# Altium schematic sheet ESP32.SchDoc: Motherboard-ESP32
size A3; DrawnBy: Patryk Bujak; DocumentNumber: 12; Revision: 1.0; SheetNumber: 9; SheetTotal: 10; Author: Patryk Bujak
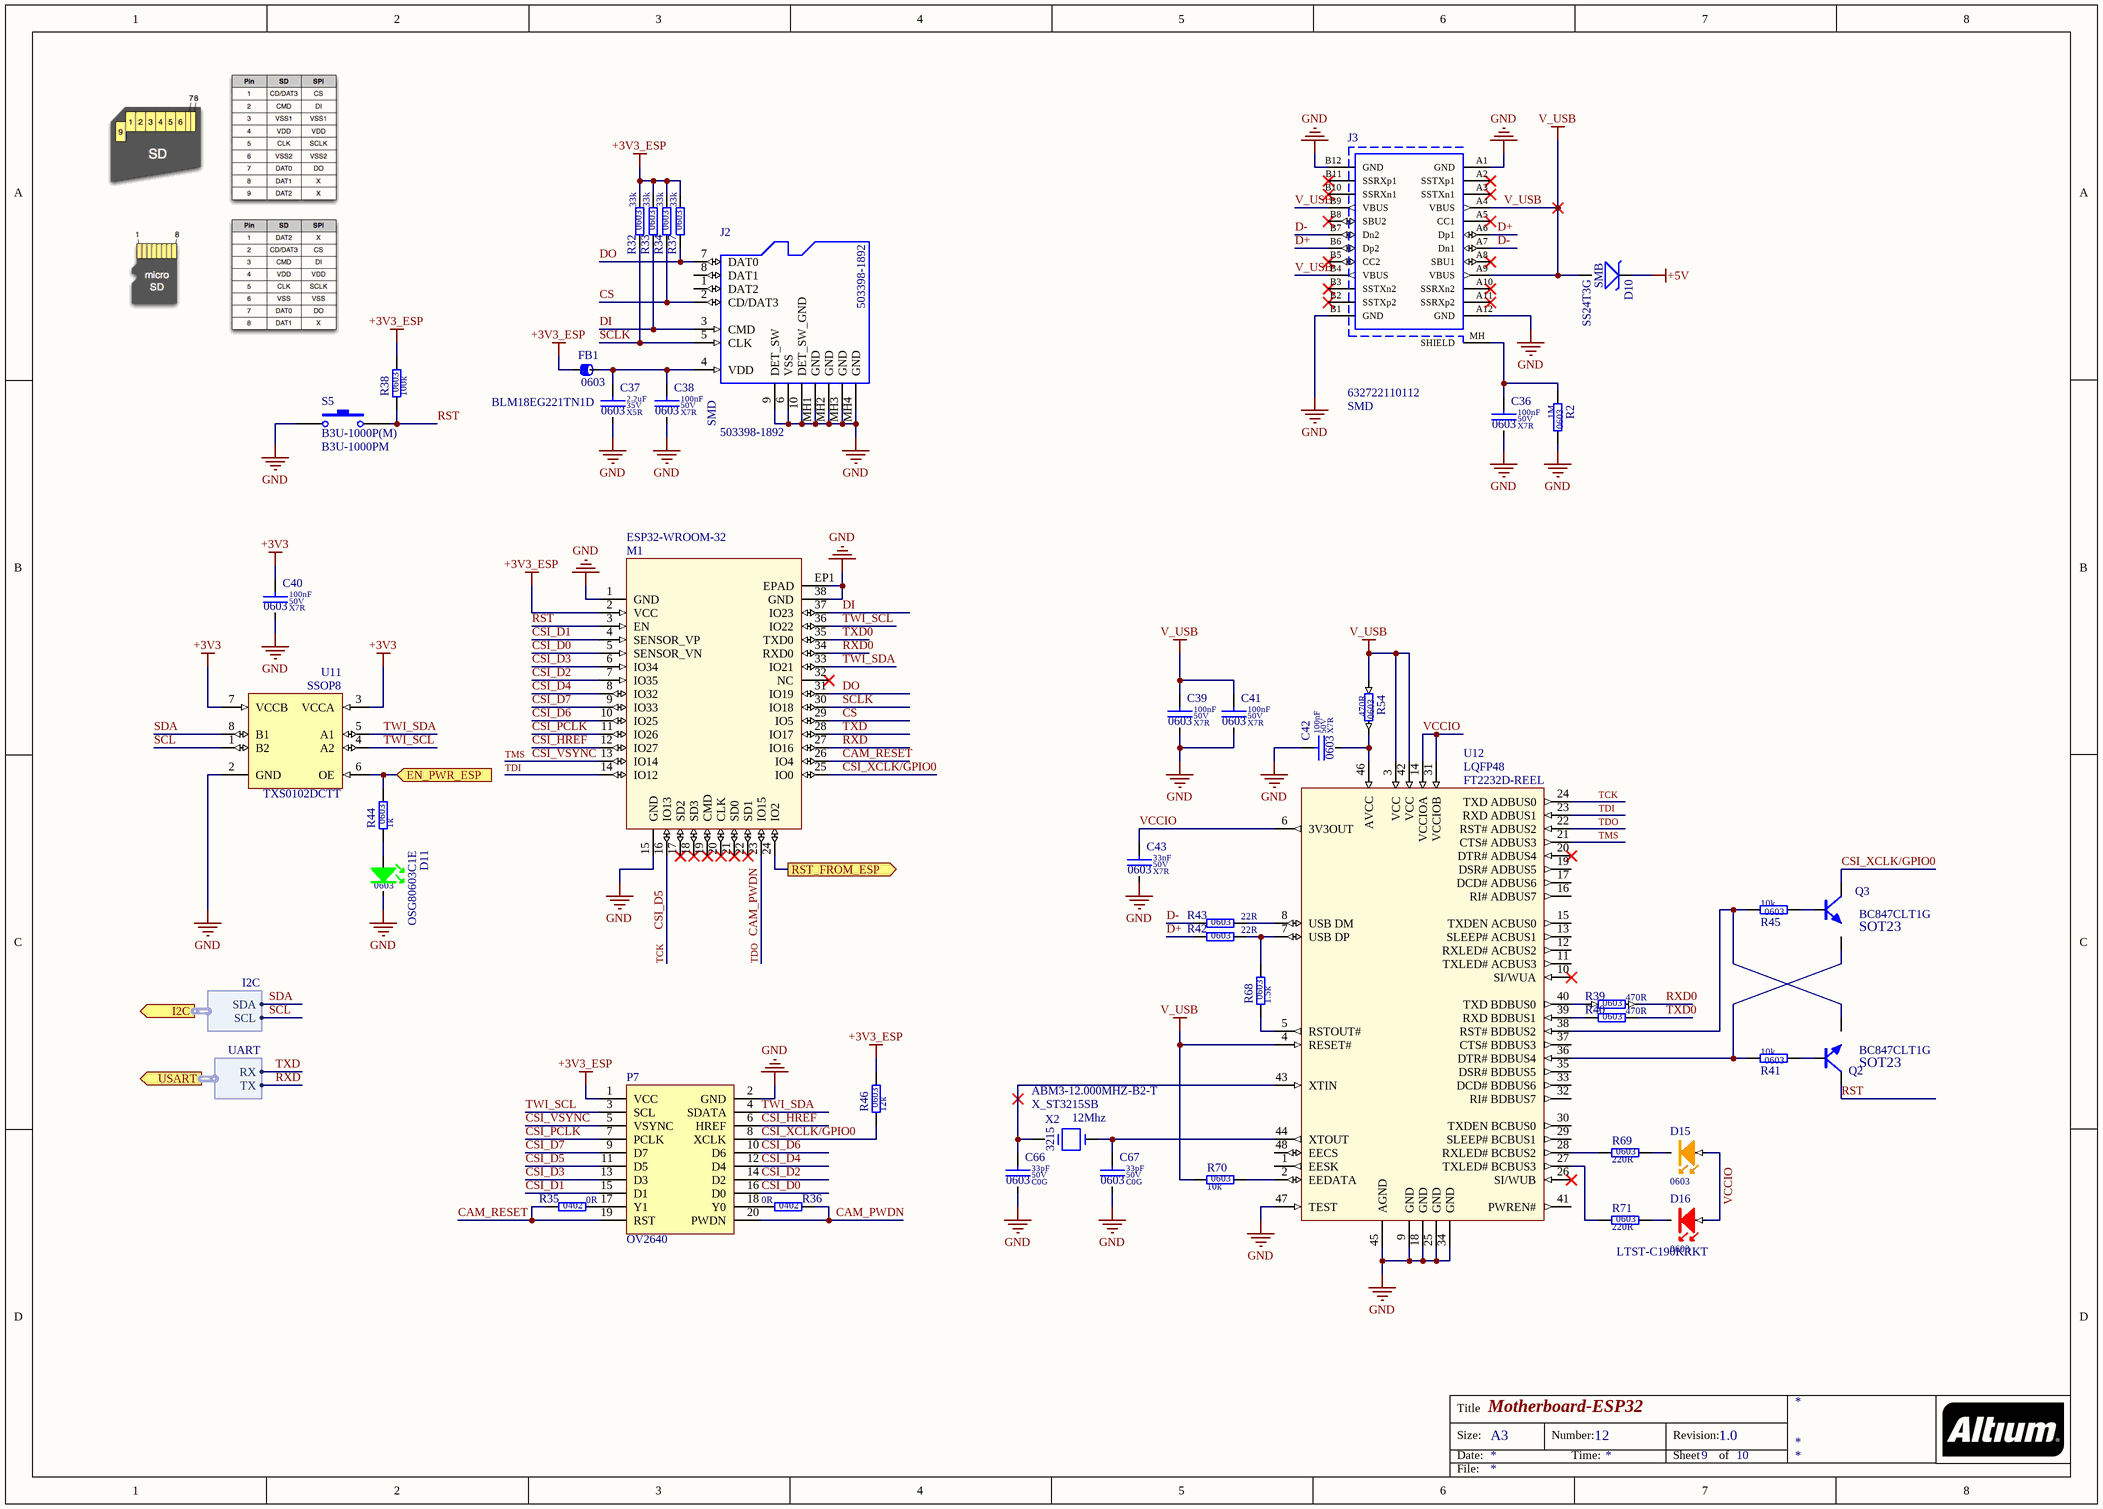
[diagram p0: ESP32.SchDoc]

## Parts
C36  value 100nF  Dielectric: X7R  Voltage: 50V  SCH_Footprint: 0603  [C_0603_1608]  (hidden comment: Ceramic X7R)
C37  value 2.2uF  Dielectric: X5R  Voltage: 35V  SCH_Footprint: 0603  [C_0603_1608]  (hidden comment: Ceramic X5R)
C38  value 100nF  Dielectric: X7R  Voltage: 50V  SCH_Footprint: 0603  [C_0603_1608]  (hidden comment: Ceramic X7R)
C39  value 100nF  Dielectric: X7R  Voltage: 50V  SCH_Footprint: 0603  [C_0603_1608]  (hidden comment: Ceramic X7R)
C40  value 100nF  Dielectric: X7R  Voltage: 50V  SCH_Footprint: 0603  [C_0603_1608]  (hidden comment: Ceramic X7R)
C41  value 100nF  Dielectric: X7R  Voltage: 50V  SCH_Footprint: 0603  [C_0603_1608]  (hidden comment: Ceramic X7R)
C42  value 100nF  Dielectric: X7R  Voltage: 50V  SCH_Footprint: 0603  [C_0603_1608]  (hidden comment: Ceramic X7R)
C43  value 33nF  Dielectric: X7R  Voltage: 50V  SCH_Footprint: 0603  [C_0603_1608]  (hidden comment: Ceramic X7R)
C66  value 33pF  Dielectric: C0G  Voltage: 50V  SCH_Footprint: 0603  [C_0603_1608]  (hidden comment: Ceramic C0G)
C67  value 33pF  Dielectric: C0G  Voltage: 50V  SCH_Footprint: 0603  [C_0603_1608]  (hidden comment: Ceramic C0G)
D10  value SS24T3G  SCH_Footprint: SMB  [SMB_DO-214AA]  (hidden comment: SS24)
D11  value OSG80603C1E  SCH_Footprint: 0603  [OL_0603_1608]  (hidden comment: Green led)
D15  SCH_Footprint: 0603  [OL_0603_1608]  (hidden comment: OL_O)
D16  value LTST-C190KRKT  SCH_Footprint: 0603  [OL_0603_1608]  (hidden comment: Red Led)
FB1  value BLM18EG221TN1D  SCH_Footprint: 0603  [FB_0603_1608]  (hidden comment: Ferrite bead)
J2  value 503398-1892  SCH_Footprint: SMD  [503398-1892]  (hidden comment: SD Card Connector)
J3  value 632722110112  SCH_Footprint: SMD  [J_USB_C_3.1_Vertical]  (hidden comment: USB C Connector)
M1  value ESP32-WROOM-32  [MOD_ESP_WROOM_32]  (hidden comment: 2.4 GHz Wi-Fi-and-Bluetooth combo chip)
P7  OV2640  [H2X10_OV2640]
Q2  value BC847CLT1G  SCH_Footprint: SOT23  [SOT23_TO236_SC59]  (hidden comment: BC847C)
Q3  value BC847CLT1G  SCH_Footprint: SOT23  [SOT23_TO236_SC59]  (hidden comment: BC847C)
R2  value 1M  SCH_Footprint: 0603  [R_0603_1608]  (hidden comment: Resistor)
R32  value 33k  SCH_Footprint: 0603  [R_0603_1608]  (hidden comment: Resistor)
R33  value 33k  SCH_Footprint: 0603  [R_0603_1608]  (hidden comment: Resistor)
R34  value 33k  SCH_Footprint: 0603  [R_0603_1608]  (hidden comment: Resistor)
R35  value 0R  SCH_Footprint: 0402  [R_0402_1005]  (hidden comment: Resistor)
R36  value 0R  SCH_Footprint: 0402  [R_0402_1005]  (hidden comment: Resistor)
R37  value 33k  SCH_Footprint: 0603  [R_0603_1608]  (hidden comment: Resistor)
R38  value 100k  SCH_Footprint: 0603  [R_0603_1608]  (hidden comment: Resistor)
R39  value 470R  SCH_Footprint: 0603  [R_0603_1608]  (hidden comment: Resistor)
R40  value 470R  SCH_Footprint: 0603  [R_0603_1608]  (hidden comment: Resistor)
R41  value 10k  SCH_Footprint: 0603  [R_0603_1608]  (hidden comment: Resistor)
R42  value 22R  SCH_Footprint: 0603  [R_0603_1608]  (hidden comment: Resistor)
R43  value 22R  SCH_Footprint: 0603  [R_0603_1608]  (hidden comment: Resistor)
R44  value 1k  SCH_Footprint: 0603  [R_0603_1608]  (hidden comment: Resistor)
R45  value 10k  SCH_Footprint: 0603  [R_0603_1608]  (hidden comment: Resistor)
R46  value 12k  SCH_Footprint: 0603  [R_0603_1608]  (hidden comment: Resistor)
R54  value 470R  SCH_Footprint: 0603  [R_0603_1608]  (hidden comment: Resistor)
R68  value 1.5k  SCH_Footprint: 0603  [R_0603_1608]  (hidden comment: Resistor)
R69  value 220R  SCH_Footprint: 0603  [R_0603_1608]  (hidden comment: Resistor)
R70  value 10k  SCH_Footprint: 0603  [R_0603_1608]  (hidden comment: Resistor)
R71  value 220R  SCH_Footprint: 0603  [R_0603_1608]  (hidden comment: Resistor)
S5  value B3U-1000PM  SCH_Footprint: B3U-1000P(M)  [B3U-1000P]  (hidden comment: Ultra-small Tactile Switch)
U11  value TXS0102DCTT  SCH_Footprint: SSOP8  [SSOP8_3x3]  (hidden comment: 2-Bit Bidirectional Voltage-Level Shifter for Open-Drain and Push-Pull Application 8-VSSOP -40 to 85)
U12  value FT2232D-REEL  SCH_Footprint: LQFP48  [LQFP48_7x7]  (hidden comment: FT2232D)
X2  value 12Mhz  Manufacturer Part Number: ABM3-12.000MHZ-B2-T  [X_ABM3-12.000MHZ-B2-T]  (hidden comment: X_ST3215SB)

## Ports
EN_PWR_ESP (in), I2C (out, harness I2C), RST_FROM_ESP (out), USART (out, harness UART)

## Harnesses
I2C: SDA, SCL
UART: RX, TX

## Nets
+3V3: C40.1 U11.3(VCCA) U11.7(VCCB)
+3V3_ESP: FB1.1 M1.2(VCC) P7.1(VCC) R32.2 R33.2 R34.2 R37.2 R38.2 R46.2
+5V: D10.1
GND: C36.2 C37.2 C38.2 C39.2 C40.2 C41.2 C42.1 C43.2 C66.2 C67.2 D11.1(K) J2.6(VSS) J2.9(DET_SW) J2.10(DET_SW_GND) J2.MH1(GND) J2.MH2(GND) J2.MH3(GND) J2.MH4(GND) J3.A1(GND) J3.A12(GND) J3.B1(GND) J3.B12(GND) M1.1(GND) M1.15(GND) M1.38(GND) M1.EP1(EPAD) P7.2(GND) R2.2 S5.1 U11.2(GND) U12.9(GND) U12.18(GND) U12.25(GND) U12.34(GND) U12.45(AGND) U12.47(TEST)
V_USB: C39.1 C41.1 D10.2 J3.A4(VBUS) J3.A9(VBUS) J3.B4(VBUS) J3.B9(VBUS) R54.1 R70.1 U12.3(VCC) U12.4(RESET#) U12.42(VCC)
CAM_PWDN: M1.23(IO15) P7.20(PWDN) R36.2 U12.22(RST#_ADBUS2)  [also labelled TDO]
CAM_RESET: M1.26(IO4) P7.19(RST) R35.1
CS: J2.2(CD/DAT3) M1.29(IO5) R34.1
CSI_D0: M1.5(SENSOR_VN) P7.16(D0)
CSI_D1: M1.4(SENSOR_VP) P7.15(D1)
CSI_D2: M1.7(IO35) P7.14(D2)
CSI_D3: M1.6(IO34) P7.13(D3)
CSI_D4: M1.8(IO32) P7.12(D4)
CSI_D5: M1.16(IO13) P7.11(D5) U12.24(TXD_ADBUS0)  [also labelled TCK]
CSI_D6: M1.10(IO25) P7.10(D6)
CSI_D7: M1.9(IO33) P7.9(D7)
CSI_HREF: M1.12(IO27) P7.6(HREF)
CSI_PCLK: M1.11(IO26) P7.7(PCLK)
CSI_VSYNC: M1.13(IO14) P7.5(VSYNC) U12.21(CTS#_ADBUS3)  [also labelled TMS]
CSI_XCLK/GPIO0: M1.25(IO0) P7.8(XCLK) Q3.3(C) R46.1
D+: J3.A6(Dp1) J3.B6(Dp2) R42.1
D-: J3.A7(Dn1) J3.B7(Dn2) R43.1
DI: J2.3(CMD) M1.37(IO23) R33.1
DO: J2.7(DAT0) M1.31(IO19) R37.1
EN_PWR_ESP: R44.2 U11.6(OE) ; port EN_PWR_ESP
RST: M1.3(EN) Q2.3(C) R38.1 S5.2
RST_FROM_ESP: M1.24(IO2) ; port RST_FROM_ESP
RXD: M1.27(IO16) ; port USART.TX
RXD0: M1.34(RXD0) R39.2
SCL: U11.1(B2) ; port I2C.SCL
SCLK: J2.5(CLK) M1.30(IO18) R32.1
SDA: U11.8(B1) ; port I2C.SDA
TDI: M1.14(IO12) U12.23(RXD_ADBUS1)
TWI_SCL: M1.36(IO22) P7.3(SCL) U11.4(A2)
TWI_SDA: M1.33(IO21) P7.4(SDATA) U11.5(A1)
TXD: M1.28(IO17) ; port USART.RX
TXD0: M1.35(TXD0) R40.2
VCCIO: C43.1 D15.2(A) D16.2(A) U12.6(3V3OUT) U12.14(VCCIOA) U12.31(VCCIOB)
NetC36_1: C36.1 J3.MH(SHIELD) R2.1
NetC37_1: C37.1 C38.1 FB1.2 J2.4(VDD)
NetC42_2: C42.2 R54.2 U12.46(AVCC)
NetC66_1: C66.1 U12.43(XTIN) X2.1
NetC67_1: C67.1 U12.44(XTOUT) X2.2
NetD11_2: D11.2(A) R44.1
NetD15_1: D15.1(K) R69.2
NetD16_1: D16.1(K) R71.2
NetP7_17: P7.17(Y1) R35.2
NetP7_18: P7.18(Y0) R36.1
NetQ2_1: Q2.1(B) R41.2
NetQ2_2: Q2.2(E) R45.1 U12.38(RST#_BDBUS2)
NetQ3_1: Q3.1(B) R45.2
NetQ3_2: Q3.2(E) R41.1 U12.36(DTR#_BDBUS4)
NetR39_1: R39.1 U12.40(TXD_BDBUS0)
NetR40_1: R40.1 U12.39(RXD_BDBUS1)
NetR42_2: R42.2 R68.2 U12.7(USB_DP)
NetR43_2: R43.2 U12.8(USB_DM)
NetR68_1: R68.1 U12.5(RSTOUT#)
NetR69_1: R69.1 U12.28(RXLED#_BCBUS2)
NetR70_2: R70.2 U12.2(EEDATA)
NetR71_1: R71.1 U12.27(TXLED#_BCBUS3)

Not connected (* = marked no-connect by the designer): J2 1(DAT2) 8(DAT1); J3 A2(SSTXp1)* A3(SSTXn1)* A5(CC1)* A8(SBU1)* A10(SSRXn2)* A11(SSRXp2)* B2(SSTXp2)* B3(SSTXn2)* B5(CC2)* B8(SBU2)* B10(SSRXn1)* B11(SSRXp1)*; M1 17(SD2)* 18(SD3)* 19(CMD)* 20(CLK)* 21(SD0)* 22(SD1)* 32(NC)*; U12 1(EESK) 10(SI/WUA)* 11(TXLED#_ACBUS3) 12(RXLED#_ACBUS2) 13(SLEEP#_ACBUS1) 15(TXDEN_ACBUS0) 16(RI#_ADBUS7) 17(DCD#_ADBUS6) 19(DSR#_ADBUS5) 20(DTR#_ADBUS4)* 26(SI/WUB)* 29(SLEEP#_BCBUS1) 30(TXDEN_BCBUS0) 32(RI#_BDBUS7) 33(DCD#_BDBUS6) 35(DSR#_BDBUS5) 37(CTS#_BDBUS3) 41(PWREN#) 48(EECS)

## Notes on the sheet
- Title
- Size:
- Date:
- A3
- Number:
- Time:
- Revision:
- Sheet
- of
- File:
- (in symbol X_ABM3-12.000MHZ-B2-T) 3215

## Library data of the parts
C36 C38-C42 = C_100nF_50V_X7R_0603_5: Capacitor; Manufacturer: Samsung; Manufacturer Part Number: CL10B104JB8NNNC; Tolerance (%): 5; Part Number: C_100nF_50V_X7R_0603_5; HelpURL: http://www.tme.eu/pl/Document/4a42202b32dab16128fe107dd69598cc/samsung-chip-cap.pdf; Supplier 1: TME; Supplier Part Number 1: CL10B104JB8NNNC; Supplier 2: RS Components; Supplier Part Number 2: 7665455; Supplier 3: Farnell; Supplier 4: Mouser; Supplier 5: Digi-Key; Supplier Part Number 5: 1276-1033-1-ND; Supplier 6: LCSC; Supplier Part Number 6: C24452
C37 = C_2.2uF_35V_X5R_0603_10: Capacitor; Manufacturer: Murata; Manufacturer Part Number: GRM188R6YA225KA12D; Tolerance (%): 10; Part Number: C_2.2uF_35V_X5R_0603_10; HelpURL: https://datasheet.octopart.com/GRM188R6YA225KA12D-Murata-datasheet-66077095.pdf; Supplier 1: TME; Supplier 2: RS Components; Supplier Part Number 2: 8151358; Supplier 3: Farnell; Supplier Part Number 3: 2611926; Supplier 4: Mouser; Supplier Part Number 4: 81-GRM188R6YA225KA2D; Supplier 5: Digi-Key; Supplier Part Number 5: 490-7204-1-ND; Supplier 6: LCSC
C43 = C_33nF_50V_X7R_0603_10: Capacitor; Manufacturer: Yageo; Manufacturer Part Number: CC0603KRX7R9BB333; Tolerance (%): 10; Part Number: C_33nF_50V_X7R_0603_10; HelpURL: https://datasheet.octopart.com/CC0603KRX7R9BB333-Yageo-datasheet-10883670.pdf; Supplier 1: TME; Supplier 2: RS Components; Supplier 3: Farnell; Supplier 4: Mouser; Supplier 5: Digi-Key; Supplier 6: LCSC
C66 C67 = C_33pF_50V_C0G_0603_5: Capacitor; Manufacturer: AVX; Manufacturer Part Number: 06035A330JAT2A; Tolerance (%): 5; Part Number: C_33pF_50V_C0G_0603_5; HelpURL: http://datasheet.octopart.com/06035A330JAT2A-AVX-datasheet-9883399.pdf; Supplier 1: TME; Supplier Part Number 1: 06035A330JAT2A; Supplier 2: RS Components; Supplier Part Number 2: 4646442; Supplier 3: Farnell; Supplier Part Number 3: 498555; Supplier 4: Mouser; Supplier Part Number 4: 581-06035A330J; Supplier 5: Digi-Key; Supplier Part Number 5: 478-1169-1-ND; Supplier 6: LCSC
D10 = DS_SS24_2A_40V_SMB: Manufacturer: ON Semiconductor; Voltage: 40V; Current: 2A; Part Number: DS_SS24_2A_40V_SMB; Manufacturer Part Number: SS24T3G; Supplier 1: TME; Supplier 2: RS Components; Supplier 3: Farnell; Supplier 4: Mouser; Supplier 5: Digi-Key; Supplier Part Number 5: SS24T3GOSCT-ND; Supplier 6: LCSC
D11 = OL_G_0603_OSG80603C1E: LED GREEN; Manufacturer: Optosupply; Part Number: OL_G_0603_OSG80603C1E; Manufacturer Part Number: OSG80603C1E; Supplier 1: TME; Supplier Part Number 1: OSG80603C1E; Supplier 2: RS Components; Supplier 3: Farnell; Supplier 4: Mouser; Supplier 5: Digi-Key; Supplier 6: LCSC
D15 = OL_O_0603: LED_RED; Part Number: OL_O_0603; Supplier 1: TME; Supplier 2: RS Components; Supplier 3: Farnell; Supplier 4: Mouser; Supplier Part Number 4: 859-LTST-C191KFKT; Supplier 5: Digi-Key; Supplier Part Number 5: 160-1445-1-ND; Supplier 6: LCSC
D16 = OL_R_0603: LED_RED; Manufacturer: Lite-On; Part Number: OL_R_0603; HelpURL: https://datasheet.octopart.com/LTST-C190KRKT-Lite-On-datasheet-158191.pdf; Manufacturer Part Number: LTST-C190KRKT; Supplier 1: TME; Supplier Part Number 1: LTST-C190KRKT; Supplier 2: RS Components; Supplier Part Number 2: 1769795; Supplier 3: Farnell; Supplier 4: Mouser; Supplier Part Number 4: 859-LTST-C190KRKT; Supplier 5: Digi-Key; Supplier Part Number 5: 160-1436-1-ND; Supplier 6: LCSC
FB1 = FB_BLM18EG221TN1D: Manufacturer: Murata; Current: 1A; Resistance: 150mR; Part Number: FB_BLM18EG221TN1D; HelpURL: http://datasheet.octopart.com/BLM18EG221TN1D-Murata-datasheet-66919.pdf; Manufacturer Part Number: BLM18EG221TN1D; Supplier 1: TME; Supplier 2: RS Components; Supplier Part Number 2: 7926243P; Supplier 3: Farnell; Supplier Part Number 3: 1515717; Supplier 4: Mouser; Supplier Part Number 4: 81-BLM18EG221TN1D; Supplier 5: Digi-Key; Supplier Part Number 5: 490-5979-1-ND; Supplier 6: LCSC
J2 = J_MICRO_SD_503398-1892: J_MICRO_SD; Manufacturer: Molex; Manufacturer Part Number: 503398-1892; Part Number: J_MICRO_SD_503398-1892; HelpURL: https://www.molex.com/pdm_docs/sd/5033981892_sd.pdf; Supplier 1: TME; Supplier Part Number 1: MX-503398-1892; Supplier 2: RS Components; Supplier Part Number 2: 8801277P; Supplier 3: Farnell; Supplier Part Number 3: 2358233; Supplier 4: Mouser; Supplier Part Number 4: 538-503398-1892; Supplier 5: Digi-Key; Supplier Part Number 5: WM11190CT-ND; Supplier 6: LCSC
J3 = J_USB_C_3.1_Vertical: Manufacturer: Wurth; Part Number: J_USB_C_3.1_Vertical; HelpURL: https://docs-emea.rs-online.com/webdocs/16e6/0900766b816e664c.pdf; Manufacturer Part Number: 632722110112; Supplier 1: TME; Supplier 2: RS Components; Supplier Part Number 2: 185-4394; Supplier 3: Farnell; Supplier 4: Mouser; Supplier Part Number 4: 710-632722110112; Supplier 5: Digi-Key; Supplier Part Number 5: 732-13724-1-ND; Supplier 6: LCSC
M1 = MOD_ESP32-WROOM-32: Manufacturer: ESPRESSIF; SCH_Footprint: MOD_ESP_WROOM_32; Part Number: MOD_ESP32-WROOM-32; HelpURL: https://www.espressif.com/sites/default/files/documentation/esp32_datasheet_en.pdf; Manufacturer Part Number: ESP32-WROOM-32; Supplier 1: TME; Supplier Part Number 1: ESP32-WROOM-32; Supplier 2: RS Components; Supplier Part Number 2: 169-7594; Supplier 3: Farnell; Supplier 4: Mouser; Supplier Part Number 4: 356-ESP-WROOM-32; Supplier 5: Digi-Key; Supplier Part Number 5: 1904-1010-1-ND; Supplier 6: LCSC
P7 = OV2640: Header, 11-Pin, Dual row, Right Angle; LatestRevisionDate: 17-Jul-2002; LatestRevisionNote: Re-released for DXP Platform.; Publisher: Altium Limited; botland: https://botland.com.pl/pl/kamery-do-arduino-i-raspberry-pi/6562-modul-kamery-arducam-ov2640-2mpx-1600x1200px-60fps.html?search_query=OV2640&results=11; link: https://www.arducam.com/products/camera-breakout-board/2mp-ov2640/
Q2 Q3 = QNP_BC847C_45V_0A1: Manufacturer: ON Semiconductor; Type: NPN; Voltage: 45V; Current: 0A1; Part Number: QNP_BC847C_45V_0A1; HelpURL: https://assets.nexperia.com/documents/data-sheet/BC847_SER.pdf; Manufacturer Part Number: BC847CLT1G; Supplier 1: TME; Supplier Part Number 1: BC847CLT1G; Supplier 2: RS Components; Supplier 3: Farnell; Supplier Part Number 3: 1459038; Supplier 4: Mouser; Supplier Part Number 4: 863-BC847CLT1G; Supplier 5: Digi-Key; Supplier Part Number 5: BC847CLT1GOSCT-ND; Supplier 6: LCSC
R2 = R_1M_0603_1: Manufacturer: Bourns; Manufacturer Part Number: CR0603-FX-1004ELF; Voltage: 50V; Power: 100mW; Tolerance: 1%; Part Number: R_1M_0603_1; HelpURL: https://datasheet.octopart.com/CR0603-FX-1004ELF-Bourns-datasheet-5318152.pdf; Supplier 1: TME; Supplier 2: RS Components; Supplier 3: Farnell; Supplier Part Number 3: 2321755; Supplier 4: Mouser; Supplier Part Number 4: 652-CR0603FX-1004ELF; Supplier 5: Digi-Key; Supplier Part Number 5: CR0603-FX-1004ELFCT-ND; Supplier 6: LCSC
R32-R34 R37 = R_33k_0603_1: Manufacturer: Vishay; Manufacturer Part Number: CRCW060333K0FKTABC; Voltage: 75V; Power: 100mW; Tolerance: 1%; Part Number: R_33k_0603_1; HelpURL: http://www.tme.eu/pl/Document/622e28308c06d160637f2b14751ba16b/Data%20Sheet%20CRCW_BCe3.pdf; Supplier 1: TME; Supplier Part Number 1: CRCW060333K0FKTABC; Supplier 2: RS Components; Supplier 3: Farnell; Supplier 4: Mouser; Supplier Part Number 4: 71-CRCW0603-33K; Supplier 5: Digi-Key; Supplier 6: LCSC
R35 R36 = R_0R_0402_5: Manufacturer: Yageo; Manufacturer Part Number: RC0402JR-070RL; Voltage: 50V; Power: 63mW; Tolerance: 5%; Part Number: R_0R_0402_5; HelpURL: https://datasheet.octopart.com/RC0402JR-070RL-Yageo-datasheet-10408619.pdf; Supplier 1: TME; Supplier Part Number 1: RC0402JR-070R; Supplier 2: RS Components; Supplier Part Number 2: 6185804; Supplier 3: Farnell; Supplier Part Number 3: 9232516; Supplier 4: Mouser; Supplier Part Number 4: 603-RC0402JR-070RL; Supplier 5: Digi-Key; Supplier Part Number 5: 311-0.0JRCT-ND; Supplier 6: LCSC; Supplier Part Number 6: C60485
R38 = R_100k_0603_1: Manufacturer: Royalohm; Manufacturer Part Number: 0603SAF1003T5E; Voltage: 50V; Power: 100mW; Tolerance: 1%; Part Number: R_100k_0603_1; HelpURL: http://www.tme.eu/pl/Document/b315665a56acbc42df513c99b390ad98/ROYALOHM-THICKFILM.pdf; Supplier 1: TME; Supplier Part Number 1: SMD0603-100K-1%; Supplier 2: RS Components; Supplier 3: Farnell; Supplier 4: Mouser; Supplier Part Number 4: 667-ERJ-3EKF1003V; Supplier 5: Digi-Key; Supplier Part Number 5: P100KHCT-ND; Supplier 6: LCSC
R39 R40 R54 = R_470R_0603_1: Manufacturer: Yageo; Manufacturer Part Number: RC0603FR-07470RL; Voltage: 50V; Power: 100mW; Tolerance: 1%; Part Number: R_470R_0603_1; HelpURL: http://www.tme.eu/en/Document/9fef8ccbb584e9f6a1c931cf356afd5c/PYu-RC0603_51_RoHS_L_4.pdf; Supplier 1: TME; Supplier Part Number 1: RC0603FR-07470R; Supplier 2: RS Components; Supplier 3: Farnell; Supplier Part Number 3: 9238441; Supplier 4: Mouser; Supplier Part Number 4: 603-RC0603FR-07470RL; Supplier 5: Digi-Key; Supplier Part Number 5: 311-470HRCT-ND; Supplier 6: LCSC
R41 R45 R70 = R_10k_0603_1: Manufacturer: Vishay; Manufacturer Part Number: CRCW060310K0FKTABC; Voltage: 75V; Power: 100mW; Tolerance: 1%; Part Number: R_10k_0603_1; HelpURL: http://www.tme.eu/pl/Document/622e28308c06d160637f2b14751ba16b/Data%20Sheet%20CRCW_BCe3.pdf; Supplier 1: TME; Supplier Part Number 1: CRCW060310K0FKTABC; Supplier 2: RS Components; Supplier 3: Farnell; Supplier 4: Mouser; Supplier Part Number 4: 667-ERJ-3EKF1002V; Supplier 5: Digi-Key; Supplier Part Number 5: P10KGCT-ND; Supplier 6: LCSC
R42 R43 = R_22R_0603_5: Manufacturer: Walsin; Manufacturer Part Number: WF06P220JTL; Voltage: 50V; Power: 125mW; Tolerance: 5%; Part Number: R_22R_0603_5; HelpURL: http://www.tme.eu/pl/Document/b315665a56acbc42df513c99b390ad98/ROYALOHM-THICKFILM.pdf; Supplier 1: TME; Supplier Part Number 1: WF06P-22R-5%; Supplier 2: RS Components; Supplier 3: Farnell; Supplier 4: Mouser; Supplier 5: Digi-Key; Supplier 6: LCSC
R44 = R_1k_0603_1: Manufacturer: Vishay; Manufacturer Part Number: CRCW06031K00FKEA; Voltage: 75V; Power: 100mW; Tolerance: 1%; Part Number: R_1k_0603_1; HelpURL: http://www.farnell.com/datasheets/2310790.pdf?_ga=2.256888843.1690599162.1548417389-1379097396.1542296996&_gac=1.262631934.1547230258.Cj0KCQiAmuHhBRD0ARIsAFWyPwhX8HcvXnM3tA0ZBodZLzDIjH2ZxLpjT5LWo9bad_HPRbU8LfPq44UaAhEwEALw_wcB; Supplier 1: TME; Supplier 2: RS Components; Supplier Part Number 2: 678-9875P; Supplier 3: Farnell; Supplier Part Number 3: 1469740; Supplier 4: Mouser; Supplier Part Number 4: 71-CRCW0603-1.0K-E3; Supplier 5: Digi-Key; Supplier Part Number 5: 541-1.00KHCT-ND; Supplier 6: LCSC
R46 = R_12k_0603_1: Manufacturer: Yageo; Manufacturer Part Number: RC0603FR-0712KL; Voltage: 50V; Power: 100mW; Tolerance: 1%; Part Number: R_12k_0603_1; HelpURL: http://www.tme.eu/pl/Document/d2a72e545e5c8eb7bf2a04fa97535928/rc0603yageo.pdf; Supplier 1: TME; Supplier Part Number 1: RC0603FR-0712K; Supplier 2: RS Components; Supplier 3: Farnell; Supplier Part Number 3: 2693657; Supplier 4: Mouser; Supplier Part Number 4: 603-RC0603FR-0712KL; Supplier 5: Digi-Key; Supplier Part Number 5: 311-12.0KHRCT-ND; Supplier 6: LCSC
R68 = R_1.5k_0603_1: Manufacturer: Yageo; Manufacturer Part Number: RC0603FR-071K5L; Voltage: 50V; Power: 100mW; Tolerance: 1%; Part Number: R_1.5k_0603_1; HelpURL: https://www.tme.eu/pl/Document/d2a72e545e5c8eb7bf2a04fa97535928/rc0603yageo.pdf; Supplier 1: TME; Supplier Part Number 1: RC0603FR-071K5; Supplier 2: RS Components; Supplier 3: Farnell; Supplier Part Number 3: 9238506; Supplier 4: Mouser; Supplier Part Number 4: 603-RC0603FR-071K5L; Supplier 5: Digi-Key; Supplier Part Number 5: 311-1.50KHRCT-ND; Supplier 6: LCSC
R69 R71 = R_220R_0603_1: Manufacturer: Royalohm; Manufacturer Part Number: 0603SAF2200T5E; Voltage: 50V; Power: 100mW; Tolerance: 1%; Part Number: R_220R_0603_1; HelpURL: http://www.tme.eu/pl/Document/b315665a56acbc42df513c99b390ad98/ROYALOHM-THICKFILM.pdf; Supplier 1: TME; Supplier Part Number 1: SMD0603-220R-1%; Supplier 2: RS Components; Supplier 3: Farnell; Supplier 4: Mouser; Supplier 5: Digi-Key; Supplier 6: LCSC
S5 = S_B3U-1000PM: Tact Switch; Manufacturer: OMRON; Part Number: S_B3U-1000PM; HelpURL: https://www.tme.eu/Document/abdade7e1ca56d20235b5c747d7227eb/B3U.PDF; Manufacturer Part Number: B3U-1000PM; Supplier 1: TME; Supplier Part Number 1: B3U-1000PM; Supplier 2: RS Components; Supplier 3: Farnell; Supplier 4: Mouser; Supplier Part Number 4: 653-B3U-1000PM; Supplier 5: Digi-Key; Supplier 6: LCSC
U11 = U_TXS0102DCTT: Manufacturer: Texas Instruments; Part Number: U_TXS0102DCTT; HelpURL: http://www.ti.com/lit/ds/symlink/txs0102.pdf; Manufacturer Part Number: TXS0102DCTT; Supplier 1: TME; Supplier 2: RS Components; Supplier Part Number 2: 7098912P; Supplier 3: Farnell; Supplier Part Number 3: 2098018; Supplier 4: Mouser; Supplier Part Number 4: 595-TXS0102DCTT; Supplier 5: Digi-Key; Supplier Part Number 5: 296-32603-1-ND; Supplier 6: LCSC
U12 = U_FT2232D: FTDI; Part Number: U_FT2232D; HelpURL: https://www.ftdichip.com/Support/Documents/DataSheets/ICs/DS_FT2232D.pdf; Manufacturer: FTDI; Manufacturer Part Number: FT2232D-REEL; Supplier 1: TME; Supplier 2: RS Components; Supplier Part Number 2: 8888707; Supplier 3: Farnell; Supplier Part Number 3: 1615843; Supplier 4: Mouser; Supplier Part Number 4: 895-FT2232D; Supplier 5: Digi-Key; Supplier Part Number 5: 768-1010-1-ND; Supplier 6: LCSC
X2 = X_ABM3-12.000MHZ-B2-T: Manufacturer: ABM3; Part Number: X_ABM3-12.000MHZ-B2-T; SCH_Footprint: X_ST3215SB; HelpURL: http://www.mouser.com/ds/2/3/abm3-47699.pdf; Supplier 1: TME; Supplier 2: RS Components; Supplier 3: Farnell; Supplier Part Number 3: 2467787; Supplier 4: Mouser; Supplier 5: Digi-Key; Supplier Part Number 5: 535-9100-1-ND; Supplier 6: LCSC